# EAGLE design Thru Hole Update Nixie Board (EAGLE 9.6.2)
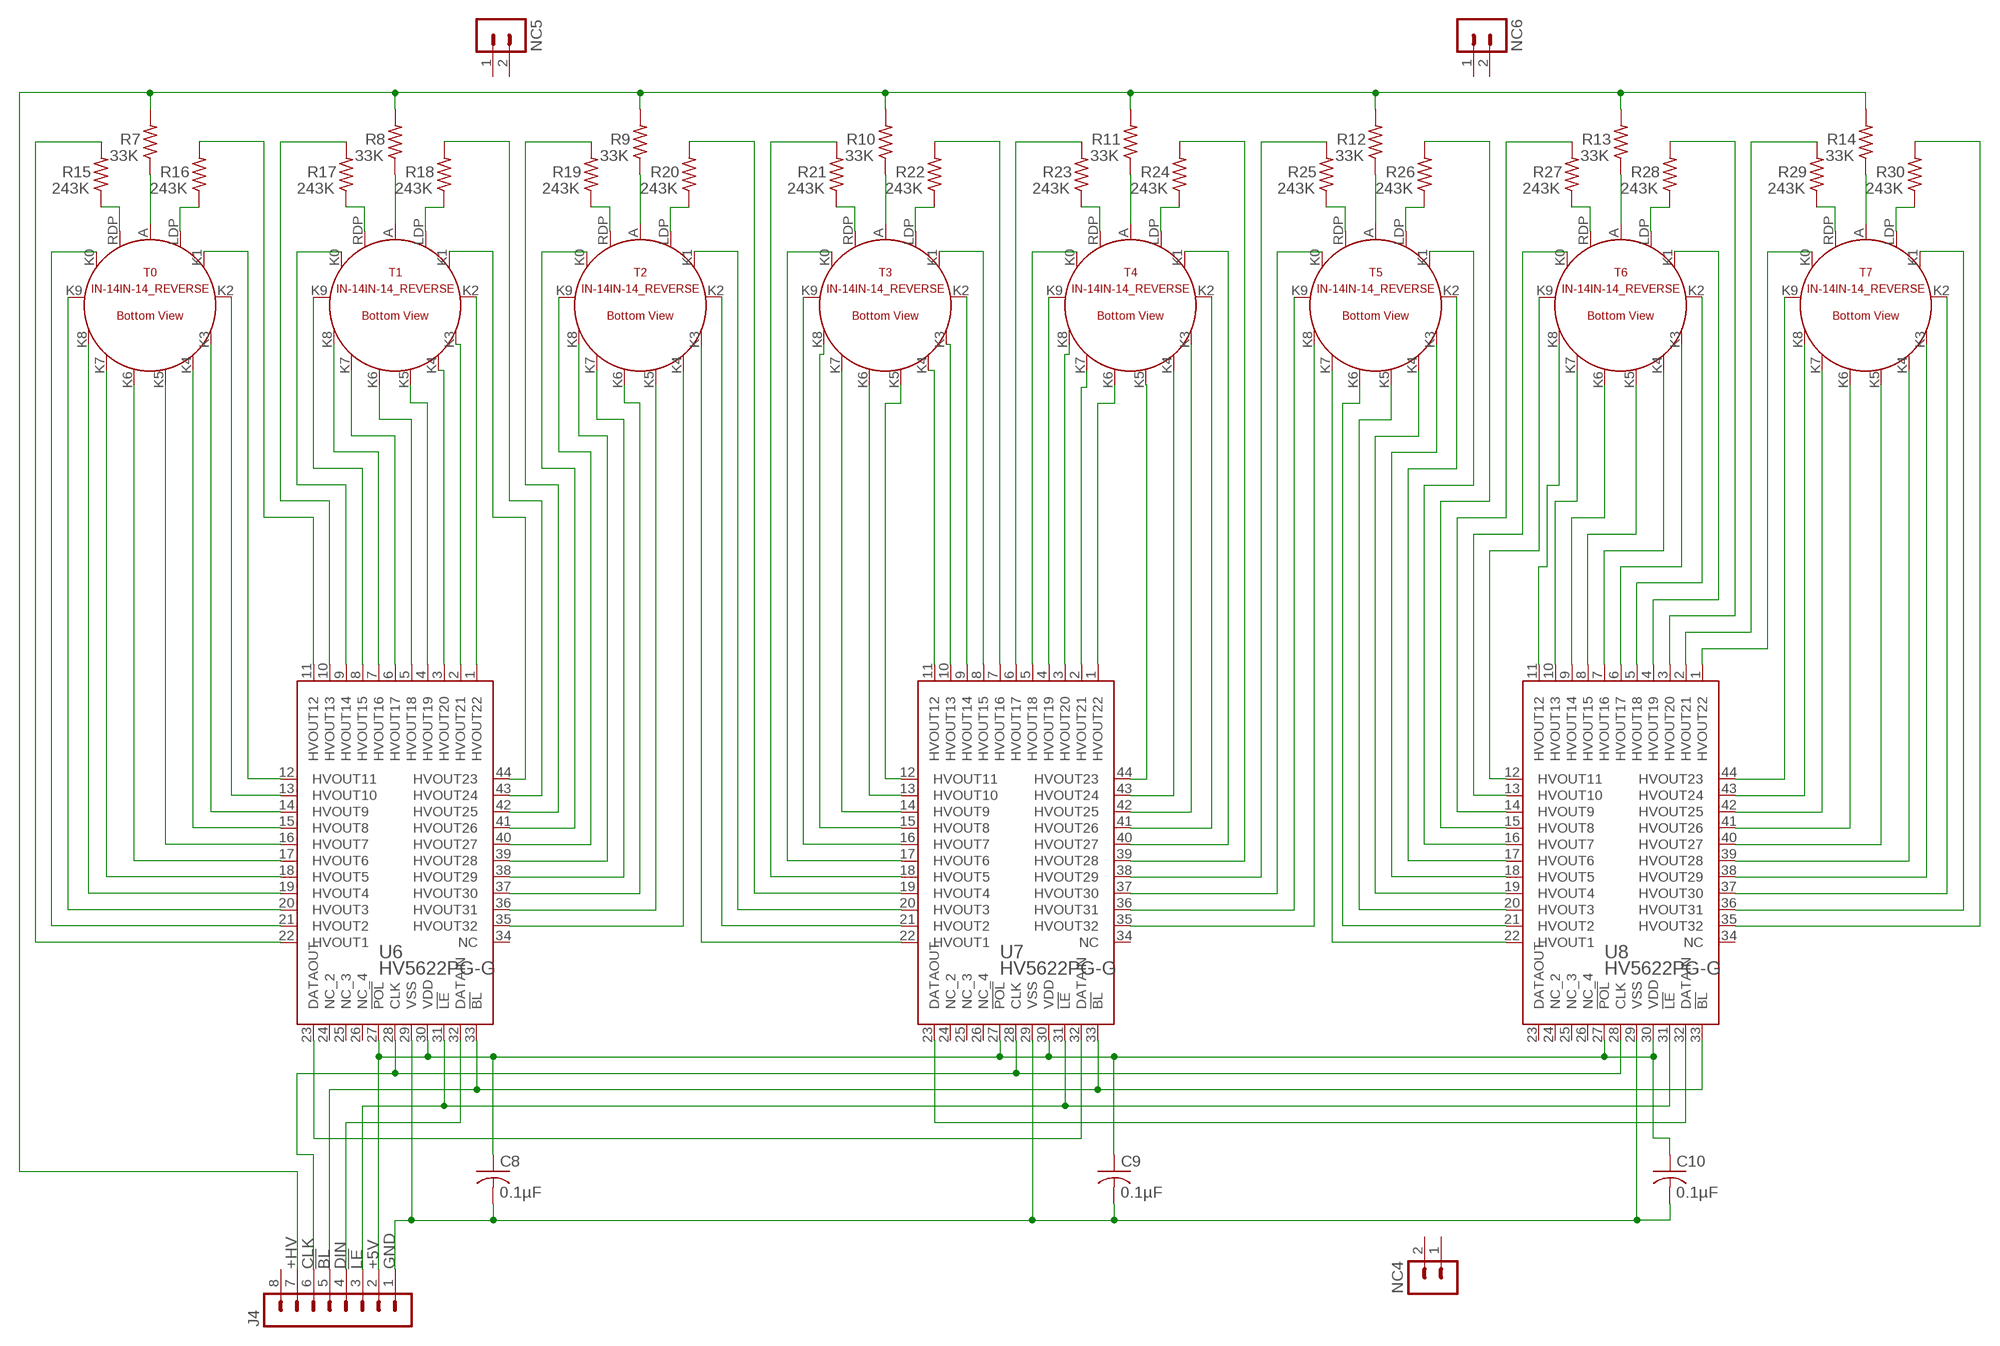
[diagram p0: schematic, sheet 1]

## Parts
C8  0.1µF  C-US  [C025-040X050]
C9  0.1µF  C-US  [C025-040X050]
C10  0.1µF  C-US  [C025-040X050]
J4  1  MA08  [MA08]
NC4  MA02  [MA02]
NC5  MA02  [MA02]
NC6  MA02  [MA02]
R7  33K  R-US0207/10  [0207/10]
R8  33K  R-US0207/10  [0207/10]
R9  33K  R-US0207/10  [0207/10]
R10  33K  R-US0207/10  [0207/10]
R11  33K  R-US0207/10  [0207/10]
R12  33K  R-US0207/10  [0207/10]
R13  33K  R-US0207/10  [0207/10]
R14  33K  R-US0207/10  [0207/10]
R15  243K  R-US0207/10  [0207/10]
R16  243K  R-US0207/10  [0207/10]
R17  243K  R-US0207/10  [0207/10]
R18  243K  R-US0207/10  [0207/10]
R19  243K  R-US0207/10  [0207/10]
R20  243K  R-US0207/10  [0207/10]
R21  243K  R-US0207/10  [0207/10]
R22  243K  R-US0207/10  [0207/10]
R23  243K  R-US0207/10  [0207/10]
R24  243K  R-US0207/10  [0207/10]
R25  243K  R-US0207/10  [0207/10]
R26  243K  R-US0207/10  [0207/10]
R27  243K  R-US0207/10  [0207/10]
R28  243K  R-US0207/10  [0207/10]
R29  243K  R-US0207/10  [0207/10]
R30  243K  R-US0207/10  [0207/10]
T0  IN-14IN-14_REVERSE  [IN-14_REVERSE]
T1  IN-14IN-14_REVERSE  [IN-14_REVERSE]
T2  IN-14IN-14_REVERSE  [IN-14_REVERSE]
T3  IN-14IN-14_REVERSE  [IN-14_REVERSE]
T4  IN-14IN-14_REVERSE  [IN-14_REVERSE]
T5  IN-14IN-14_REVERSE  [IN-14_REVERSE]
T6  IN-14IN-14_REVERSE  [IN-14_REVERSE]
T7  IN-14IN-14_REVERSE  [IN-14_REVERSE]
U6  HV5622PG-G  [QFP-44]
U7  HV5622PG-G  [QFP-44]
U8  HV5622PG-G  [QFP-44]

## Nets
!BL!: J4.5 U6.33(!BL) U7.33(!BL) U8.33(!BL)
!LE!: J4.3 U6.31(!LE) U7.31(!LE) U8.31(!LE)
+5V: C8.1 C9.1 C10.1 J4.2 U6.27(!POL) U6.30(VDD) U7.27(!POL) U7.30(VDD) U8.27(!POL) U8.30(VDD)
+HV: J4.7 R7.2 R8.2 R9.2 R10.2 R11.2 R12.2 R13.2 R14.2
CLK: J4.6 U6.28(CLK) U7.28(CLK) U8.28(CLK)
DIN: J4.4 U6.32(DATAIN)
GND: C8.2 C9.2 C10.2 J4.1 U6.29(VSS) U7.29(VSS) U8.29(VSS)
T0A: R7.1 T0.A
T1A: R8.1 T1.A
T2A: R9.1 T2.A
T3A: R10.1 T3.A
T4A: R11.1 T4.A
T5A: R12.1 T5.A
T6A: R13.1 T6.A
T7A: R14.1 T7.A
U5-T0K0: T0.K0 U6.21(HVOUT2)
U5-T0K1: T0.K1 U6.12(HVOUT11)
U5-T0K2: T0.K2 U6.13(HVOUT10)
U5-T0K3: T0.K3 U6.14(HVOUT9)
U5-T0K4: T0.K4 U6.15(HVOUT8)
U5-T0K5: T0.K5 U6.16(HVOUT7)
U5-T0K6: T0.K6 U6.17(HVOUT6)
U5-T0K7: T0.K7 U6.18(HVOUT5)
U5-T0K8: T0.K8 U6.19(HVOUT4)
U5-T0K9: T0.K9 U6.20(HVOUT3)
U5-T0LDP: R16.2 U6.11(HVOUT12)
U5-T0LDP1: R16.1 T0.LDP
U5-T0RDP: R15.2 U6.22(HVOUT1)
U5-T0RDP1: R15.1 T0.RDP
U5-T1K0: T1.K0 U6.9(HVOUT14)
U5-T1K1: T1.K1 U6.44(HVOUT23)
U5-T1K2: T1.K2 U6.1(HVOUT22)
U5-T1K3: T1.K3 U6.2(HVOUT21)
U5-T1K4: T1.K4 U6.3(HVOUT20)
U5-T1K5: T1.K5 U6.4(HVOUT19)
U5-T1K6: T1.K6 U6.5(HVOUT18)
U5-T1K7: T1.K7 U6.6(HVOUT17)
U5-T1K8: T1.K8 U6.7(HVOUT16)
U5-T1K9: T1.K9 U6.8(HVOUT15)
U5-T1LDP: R18.2 U6.43(HVOUT24)
U5-T1LDP1: R18.1 T1.LDP
U5-T1RDP: R17.2 U6.10(HVOUT13)
U5-T1RDP1: R17.1 T1.RDP
U5-T2K0: T2.K0 U6.41(HVOUT26)
U5-T2K4: T2.K4 U6.35(HVOUT32)
U5-T2K5: T2.K5 U6.36(HVOUT31)
U5-T2K6: T2.K6 U6.37(HVOUT30)
U5-T2K7: T2.K7 U6.38(HVOUT29)
U5-T2K8: T2.K8 U6.39(HVOUT28)
U5-T2K9: T2.K9 U6.40(HVOUT27)
U5-T2RDP: R19.2 U6.42(HVOUT25)
U5-T2RDP1: R19.1 T2.RDP
U5-U6: U6.23(DATAOUT) U7.32(DATAIN)
U6-T2K1: T2.K1 U7.20(HVOUT3)
U6-T2K2: T2.K2 U7.21(HVOUT2)
U6-T2K3: T2.K3 U7.22(HVOUT1)
U6-T2LDP: R20.2 U7.19(HVOUT4)
U6-T2LDP1: R20.1 T2.LDP
U6-T3K0: T3.K0 U7.17(HVOUT6)
U6-T3K1: T3.K1 U7.8(HVOUT15)
U6-T3K2: T3.K2 U7.9(HVOUT14)
U6-T3K3: T3.K3 U7.10(HVOUT13)
U6-T3K4: T3.K4 U7.11(HVOUT12)
U6-T3K5: T3.K5 U7.12(HVOUT11)
U6-T3K6: T3.K6 U7.13(HVOUT10)
U6-T3K7: T3.K7 U7.14(HVOUT9)
U6-T3K8: T3.K8 U7.15(HVOUT8)
U6-T3K9: T3.K9 U7.16(HVOUT7)
U6-T3LDP: R22.2 U7.7(HVOUT16)
U6-T3LDP1: R22.1 T3.LDP
U6-T3RDP: R21.2 U7.18(HVOUT5)
U6-T3RDP1: R21.1 T3.RDP
U6-T4K0: T4.K0 U7.5(HVOUT18)
U6-T4K1: T4.K1 U7.40(HVOUT27)
U6-T4K2: T4.K2 U7.41(HVOUT26)
U6-T4K3: T4.K3 U7.42(HVOUT25)
U6-T4K4: T4.K4 U7.43(HVOUT24)
U6-T4K5: T4.K5 U7.44(HVOUT23)
U6-T4K6: T4.K6 U7.1(HVOUT22)
U6-T4K7: T4.K7 U7.2(HVOUT21)
U6-T4K8: T4.K8 U7.3(HVOUT20)
U6-T4K9: T4.K9 U7.4(HVOUT19)
U6-T4LDP: R24.2 U7.39(HVOUT28)
U6-T4LDP1: R24.1 T4.LDP
U6-T4RDP: R23.2 U7.6(HVOUT17)
U6-T4RDP1: R23.1 T4.RDP
U6-T5K0: T5.K0 U7.37(HVOUT30)
U6-T5K8: T5.K8 U7.35(HVOUT32)
U6-T5K9: T5.K9 U7.36(HVOUT31)
U6-T5RDP: R25.2 U7.38(HVOUT29)
U6-T5RDP1: R25.1 T5.RDP
U6-U7: U7.23(DATAOUT) U8.32(DATAIN)
U7-T5K1: T5.K1 U8.16(HVOUT7)
U7-T5K2: T5.K2 U8.17(HVOUT6)
U7-T5K3: T5.K3 U8.18(HVOUT5)
U7-T5K4: T5.K4 U8.19(HVOUT4)
U7-T5K5: T5.K5 U8.20(HVOUT3)
U7-T5K6: T5.K6 U8.21(HVOUT2)
U7-T5K7: T5.K7 U8.22(HVOUT1)
U7-T5LDP: R26.2 U8.15(HVOUT8)
U7-T5LDP1: R26.1 T5.LDP
U7-T6K0: T6.K0 U8.13(HVOUT10)
U7-T6K1: T6.K1 U8.4(HVOUT19)
U7-T6K2: T6.K2 U8.5(HVOUT18)
U7-T6K3: T6.K3 U8.6(HVOUT17)
U7-T6K4: T6.K4 U8.7(HVOUT16)
U7-T6K5: T6.K5 U8.8(HVOUT15)
U7-T6K6: T6.K6 U8.9(HVOUT14)
U7-T6K7: T6.K7 U8.10(HVOUT13)
U7-T6K8: T6.K8 U8.11(HVOUT12)
U7-T6K9: T6.K9 U8.12(HVOUT11)
U7-T6LDP: R28.2 U8.3(HVOUT20)
U7-T6LDP1: R28.1 T6.LDP
U7-T6RDP: R27.2 U8.14(HVOUT9)
U7-T6RDP1: R27.1 T6.RDP
U7-T7K0: T7.K0 U8.1(HVOUT22)
U7-T7K1: T7.K1 U8.36(HVOUT31)
U7-T7K2: T7.K2 U8.37(HVOUT30)
U7-T7K3: T7.K3 U8.38(HVOUT29)
U7-T7K4: T7.K4 U8.39(HVOUT28)
U7-T7K5: T7.K5 U8.40(HVOUT27)
U7-T7K6: T7.K6 U8.41(HVOUT26)
U7-T7K7: T7.K7 U8.42(HVOUT25)
U7-T7K8: T7.K8 U8.43(HVOUT24)
U7-T7K9: T7.K9 U8.44(HVOUT23)
U7-T7LDP: R30.2 U8.35(HVOUT32)
U7-T7LDP1: R30.1 T7.LDP
U7-T7RDP: R29.2 U8.2(HVOUT21)
U7-T7RDP1: R29.1 T7.RDP
Unconnected: J4.8 NC4.1 NC4.2 NC5.1 NC5.2 NC6.1 NC6.2 U6.24(NC_2) U6.25(NC_3) U6.26(NC_4) U6.34(NC) U7.24(NC_2) U7.25(NC_3) U7.26(NC_4) U7.34(NC) U8.23(DATAOUT) U8.24(NC_2) U8.25(NC_3) U8.26(NC_4) U8.34(NC)

## Library data of the parts
C8-C10 = My Imported Components:C-US
J4 = My Imported Components:MA08: PIN HEADER; OC_FARNELL: unknown; OC_NEWARK: unknown
NC4-NC6 = My Imported Components:MA02: PIN HEADER
R7-R30 = My Imported Components:R-US: RESISTOR, American symbol; SPICEPREFIX: R
T0 T1-T7 = My Imported Components:IN-14
U6-U8 = My Imported Components:HV5622PG-G; BUILT_BY: EMA_Jessica; COPYRIGHT: Copyright (C) 2018 Accelerated Designs. All rights reserved; MANUFACTURER_PART_NUMBER: HV5622PG-G; SOURCELIBRARY: Microchip_2019-08-23_19; VENDOR: Microchip

## Board
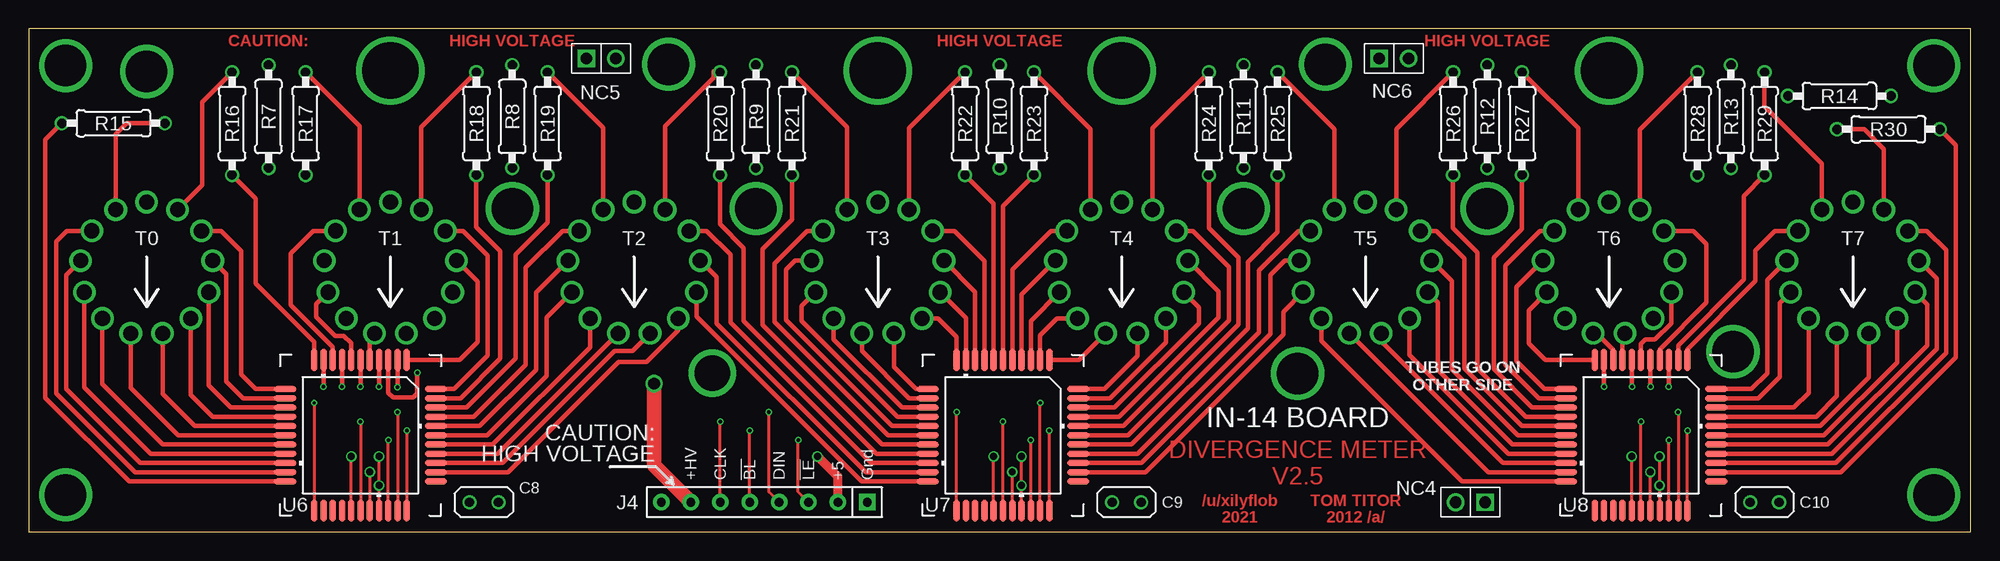
[diagram p1: board, top side]
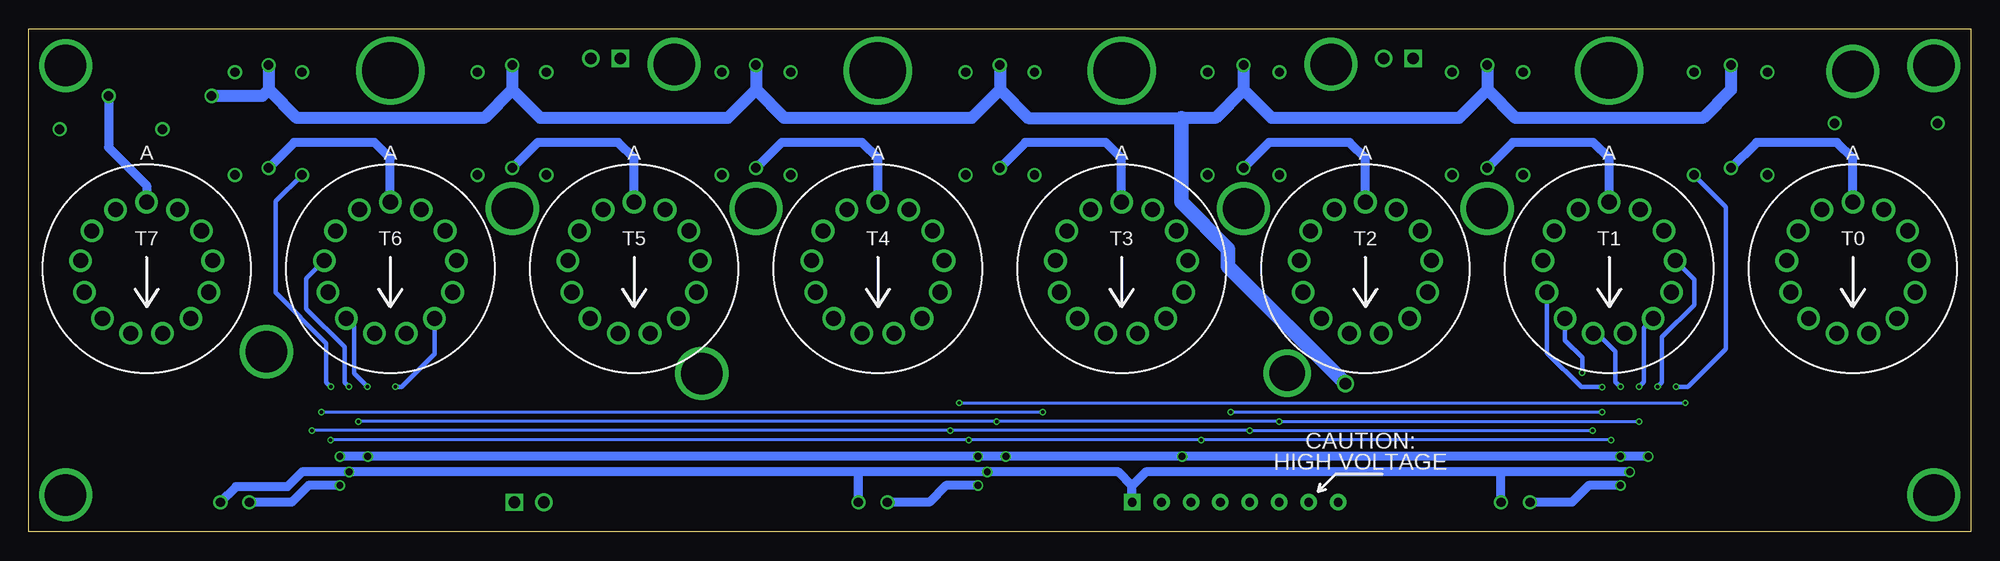
[diagram p2: board, bottom side, seen from below]

Size 167.64 x 43.43 mm. Coordinates in mm from the lower left corner, seen from the top.
Outline: 0,0 167.64,0 167.64,43.43 0,43.43 0,0
Copper layers (1*16): Top 0.035559375mm / dielectric 1.6mm / Bottom 0.035559375mm
Design rules "oshpark-2layer": minimum track width 6mil, minimum drill 10mil, track to track 6mil, track to pad 6mil, pad to pad 6mil, via to via 6mil, smd to smd 6mil, copper to edge 15mil, drill to drill 6mil, minimum pad ring 5mil, minimum via ring 5mil, stop-mask expansion 2.5mil, vias tented up to drill 0mil, thermal gap 10mil

### Footprints (pad centres in the part's own frame; a part is rotated, then mirrored left to right if it is on the bottom)
C025-040X050 = drill 0.813: 1 -1.25,0; 2 1.25,0
MA08 = drill 0.75 pad 1.422 square: 1 -8.89,0 | drill 0.75 pad 1.422: 2 -6.35,0; 3 -3.81,0; 4 -1.27,0; 5 1.27,0; 6 3.81,0; 7 6.35,0; 8 8.89,0
MA02 = drill 1 pad 1.422 square: 1 -1.27,0 | drill 1.016 pad 1.422: 2 1.27,0
0207/10 = drill 0.813: 1 -4.445,0; 2 4.445,0
IN-14_REVERSE = drill 1.3 pad 1.9: A 0,5.75; K0 4.732,3.266; K1 -4.732,3.266; K2 -5.708,0.693; K3 -5.376,-2.039; K4 -3.813,-4.304; K5 -1.376,-5.583; K6 1.376,-5.583; K7 3.813,-4.304; K8 5.376,-2.039; K9 5.708,0.693; LDP -2.672,5.091; RDP 2.672,5.091
QFP-44 = smd 1.9 x 0.55: 1 -6.5,4; 2 -6.5,3.2; 3 -6.5,2.4; 4 -6.5,1.6; 5 -6.5,0.8; 6 -6.5,0; 7 -6.5,-0.8; 8 -6.5,-1.6; 9 -6.5,-2.4; 10 -6.5,-3.2; 11 -6.5,-4; 23 6.5,-4; 24 6.5,-3.2; 25 6.5,-2.4; 26 6.5,-1.6; 27 6.5,-0.8; 28 6.5,0; 29 6.5,0.8; 30 6.5,1.6; 31 6.5,2.4; 32 6.5,3.2; 33 6.5,4 | smd 0.501 x 1.9: 12 -4,-6.5; 13 -3.2,-6.5; 14 -2.4,-6.5; 15 -1.6,-6.5; 16 -0.8,-6.5; 17 0,-6.5; 18 0.8,-6.5; 19 1.6,-6.5; 20 2.4,-6.5; 21 3.2,-6.5; 22 4,-6.5 | smd 0.55 x 1.9: 34 4,6.5; 35 3.2,6.5; 36 2.4,6.5; 37 1.6,6.5; 38 0.8,6.5; 39 0,6.5; 40 -0.8,6.5; 41 -1.6,6.5; 42 -2.4,6.5; 43 -3.2,6.5; 44 -4,6.5

### Placement (x,y rotation side)
C8  39.29,2.54 0 top
C9  94.77,2.54 0 top
C10  149.86,2.54 0 top
J4  63.5,2.54 180 top
NC4  124.46,2.54 180 top
NC5  49.4,40.89 0 top
NC6  117.86,40.89 0 top
R7  20.68,35.86 90 top
R8  41.73,35.86 90 top
R9  62.77,35.86 90 top
R10  83.82,35.86 90 top
R11  104.87,35.86 90 top
R12  125.91,35.86 90 top
R13  146.96,35.86 90 top
R14  156.31,37.64 180 top
R15  7.29,35.28 180 top
R16  17.53,35.26 270 top
R17  23.88,35.26 270 top
R18  38.63,35.26 270 top
R19  44.78,35.26 270 top
R20  59.68,35.26 270 top
R21  65.87,35.26 270 top
R22  80.82,35.26 270 top
R23  86.77,35.26 270 top
R24  101.87,35.26 270 top
R25  107.81,35.26 270 top
R26  122.97,35.26 270 top
R27  128.91,35.26 270 top
R28  144.06,35.26 270 top
R29  149.85,35.26 270 top
R30  160.55,34.77 0 top
T0  10.16,22.73 0 bottom
T1  31.21,22.73 0 bottom
T2  52.25,22.73 0 bottom
T3  73.3,22.73 0 bottom
T4  94.34,22.73 0 bottom
T5  115.39,22.73 0 bottom
T6  136.43,22.73 0 bottom
T7  157.48,22.73 0 bottom
U6  28.63,8.33 270 top
U7  84.1,8.33 270 top
U8  139.19,8.33 270 top

### Tracks (layer width: path | path; a pad name or v marks a point on that pad's centre or on a via)
!BL!  (via drill 0.3 pad 0.55)
  Top 0.254: v32.63,8.74 U6.33 | J4.5 v62.23,8.74 | U7.33 v88.1,8.74 | U8.33 v143.19,8.74
  Bottom 0.254: v32.63,8.74 v62.23,8.74 v88.1,8.74 v143.19,8.74
!LE!  (via drill 0.3 pad 0.55)
  Top 0.254: U6.31 v31.03,7.92 | U7.31 v86.5,7.92 | U8.31 v141.59,7.92 | J4.3 66.42,3.43 v66.42,7.92
  Bottom 0.254: v31.03,7.92 v66.42,7.92 v86.5,7.92 v141.59,7.92
+5V  (via drill 0.6 pad 0.8)
  Top 0.254: U6.27 v27.83,6.5 | U6.30 v30.23,3.99 v30.23,6.5 | U7.30 v85.7,3.99 v85.7,6.5 | U7.27 v83.3,6.5 | U8.30 v140.79,3.99 v140.79,6.5 | U8.27 v138.39,6.5
  Top 0.762: J4.2 69.85,4.72 v68.07,6.5
  Bottom 0.762: v27.83,6.5 v30.23,6.5 v68.07,6.5 v83.3,6.5 v85.7,6.5 v138.39,6.5 v140.79,6.5 | v140.79,3.99 143.51,3.99 144.96,2.54 C10.1 | C9.1 89.89,2.54 88.44,3.99 v85.7,3.99 | v30.23,3.99 32.97,3.99 34.42,2.54 C8.1
+HV  (via drill 1 pad 1.5)
  Top 1.27: v53.98,12.8 53.98,5.71 J4.7
  Bottom 1.016: R7.2 20.68,38.18 23.12,35.74 39.29,35.74 41.73,38.18 | R8.2 41.73,38.18 | 41.73,38.18 44.17,35.74 60.34,35.74 62.77,38.18 | R9.2 62.77,38.18 | R10.2 83.82,38.18 | R11.2 104.87,38.18 | R12.2 125.91,38.18 | R13.2 146.96,38.18 | 146.96,38.18 144.52,35.74 128.35,35.74 125.91,38.18 | 125.91,38.18 123.47,35.74 107.3,35.74 104.87,38.18 | 104.87,38.18 102.43,35.74 86.26,35.74 83.82,38.18 | 83.82,38.18 81.38,35.74 68.15,35.74 65.21,35.74 62.77,38.18 | 146.96,38.18 147.49,37.64 R14.2
  Bottom 1.27: v53.98,12.8 64.11,22.91 64.11,24.43 68.15,28.5 68.15,35.74
CLK  (via drill 0.3 pad 0.55)
  Top 0.254: v28.63,9.53 U6.28 | J4.6 v59.69,9.53 | U7.28 v84.1,9.53 | U8.28 v139.19,9.53
  Bottom 0.254: v28.63,9.53 v59.69,9.53 v84.1,9.53 v139.19,9.53
DIN  (via drill 0.3 pad 0.55)
  Top 0.254: v31.83,10.34 U6.32 | J4.4 63.88,3.43 v63.88,10.34
  Bottom 0.254: v63.88,10.34 v31.83,10.34
GND  (via drill 0.6 pad 0.8)
  Top 0.254: v29.43,5.16 U6.29 | U7.29 v84.9,5.16 | U8.29 v139.99,5.16
  Bottom 0.762: v29.43,5.16 40.54,5.16 | 40.54,5.16 71.2,5.16 72.39,3.96 | 96.01,5.16 v84.9,5.16 73.58,5.16 72.39,3.96 | 96.01,5.16 v139.99,5.16 144.07,5.16 145.34,3.89 149.76,3.89 C10.2 | C9.2 96.02,5.15 96.01,5.16 | C8.2 40.54,5.15 40.54,5.16 | J4.1 72.39,3.96
N$1  (via drill 3.05 pad 3.48)
  other vias: 59,13.69
N$2  (via drill 3.58 pad 4.01)
  other vias: 55.22,40.39
N$3  (via drill 3.58 pad 4.01)
  other vias: 104.87,27.91
N$4  (via drill 3.58 pad 4.01)
  other vias: 62.77,27.91
N$5  (via drill 3.58 pad 4.01)
  other vias: 10.16,39.75
N$6  (via drill 3.58 pad 4.01)
  other vias: 109.55,13.67
N$7  (via drill 3.58 pad 4.01)
  other vias: 111.94,40.39
N$8  (via drill 3.58 pad 4.01)
  other vias: 41.73,27.91
N$9  (via drill 3.58 pad 4.01)
  other vias: 147.14,15.54
N$10  (via drill 3.58 pad 4.27)
  other vias: 3.17,3.17
N$11  (via drill 3.58 pad 4.27)
  other vias: 164.47,3.17
N$12  (via drill 3.58 pad 4.27)
  other vias: 3.17,40.26
N$13  (via drill 3.58 pad 4.27)
  other vias: 164.47,40.26
N$14  (via drill 4.88 pad 5.59)
  other vias: 73.3,39.83
N$15  (via drill 4.88 pad 5.59)
  other vias: 94.34,39.83
N$16  (via drill 4.88 pad 5.59)
  other vias: 136.43,39.83
N$17  (via drill 4.88 pad 5.59)
  other vias: 31.21,39.83
N$18  (via drill 3.58 pad 4.01)
  other vias: 125.91,27.91
T0A
  Bottom 0.762: T0.A 10.16,32.26 11.53,33.63 18.47,33.63 R7.1
T1A
  Bottom 0.762: T1.A 31.21,32.26 32.58,33.63 39.52,33.63 R8.1
T2A
  Bottom 0.762: T2.A 52.25,32.26 53.62,33.63 60.56,33.63 R9.1
T3A
  Bottom 0.762: T3.A 73.3,32.26 74.67,33.63 81.61,33.63 R10.1
T4A
  Bottom 0.762: T4.A 94.34,32.26 95.71,33.63 102.66,33.63 R11.1
T5A
  Bottom 0.762: T5.A 115.39,32.26 116.76,33.63 123.7,33.63 R12.1
T6A
  Bottom 0.762: T6.A 136.43,32.26 137.81,33.63 144.75,33.63 R13.1
T7A
  Bottom 0.762: T7.A 157.48,29.92 160.76,33.2 R14.1
U5-T0K0
  Top 0.381: U6.21 9.17,5.13 2.34,11.96 2.34,25.08 3.25,25.99 T0.K0
U5-T0K1
  Top 0.381: U6.12 19.58,12.33 18.31,13.6 18.31,24.26 16.58,25.99 T0.K1
U5-T0K2
  Top 0.381: U6.13 18.48,11.53 17.04,12.97 17.04,22.24 T0.K2
U5-T0K3
  Top 0.381: U6.14 17.43,10.73 15.54,12.62 T0.K3
U5-T0K4
  Top 0.381: U6.15 15.88,9.93 13.97,11.84 T0.K4
U5-T0K5
  Top 0.381: U6.16 14.29,9.13 11.54,11.89 T0.K5
U5-T0K6
  Top 0.381: U6.17 12.87,8.33 8.78,12.42 T0.K6
U5-T0K7
  Top 0.381: U6.18 11.57,7.53 6.35,12.75 T0.K7
U5-T0K8
  Top 0.381: U6.19 10.5,6.73 4.78,12.45 T0.K8
U5-T0K9
  Top 0.381: U6.20 9.61,5.93 3.23,12.32 3.23,22.19 T0.K9
U5-T0LDP
  Top 0.381: U6.11 24.63,16.39 19.58,21.44 19.58,28.76 R16.2
U5-T0LDP1
  Top 0.381: T0.LDP 14.96,29.95 14.96,37.13 R16.1
U5-T0RDP
  Top 0.381: U6.22 8.65,4.33 1.42,11.56 1.42,33.86 R15.2
U5-T0RDP1
  Top 0.381: T0.RDP 7.49,34.34 8.43,35.28 R15.1
U5-T1K0
  Top 0.381: U6.9 26.23,15.95 22.59,19.58 22.59,24.03 24.56,25.99 T1.K0
U5-T1K1
  Top 0.381: U6.44 36.73,12.33 39.61,15.21 39.61,23.85 37.47,25.99 T1.K1
U5-T1K2
  Top 0.381: U6.1 37.17,14.83 38.72,16.38 38.72,21.61 T1.K2
U5-T1K3  (via drill 0.3 pad 0.55)
  Top 0.381: U6.2 v31.83,12.5
  Bottom 0.381: v31.83,12.5 33.62,12.5 36.58,15.46 T1.K3
U5-T1K4  (via drill 0.3 pad 0.55)
  Top 0.381: U6.3 31.03,12 31.45,11.58 33.17,11.58 33.53,11.94 v33.53,13.74
  Bottom 0.381: v33.53,13.74 33.53,15.04 35.02,16.53 T1.K4
U5-T1K5  (via drill 0.3 pad 0.55)
  Top 0.381: U6.4 v30.23,12.52
  Bottom 0.381: v30.23,12.52 30.65,12.94 30.65,15.56 32.23,17.14 T1.K5
U5-T1K6
  Top 0.381: U6.5 29.43,16.74 T1.K6
U5-T1K7  (via drill 0.3 pad 0.55)
  Top 0.381: U6.6 v28.63,12.52
  Bottom 0.381: v28.63,12.52 28.21,12.94 28.21,17.61 T1.K7
U5-T1K8
  Top 0.381: U6.7 27.83,16.28 27.19,16.92 26.43,16.92 24.8,18.54 24.8,19.66 T1.K8
U5-T1K9  (via drill 0.3 pad 0.55)
  Top 0.381: U6.8 v27.03,12.52
  Bottom 0.381: v27.03,12.52 26.63,12.91 26.63,16.82 23.86,19.58 23.86,21.79 T1.K9
U5-T1LDP
  Top 0.381: U6.43 37.26,11.53 40.69,14.96 40.69,24.25 38.63,26.31 R18.2
U5-T1LDP1
  Top 0.381: T1.LDP 33.88,34.95 R18.1
U5-T1RDP  (via drill 0.3 pad 0.55)
  Top 0.381: U6.10 v25.43,12.52
  Bottom 0.381: v25.43,12.52 24.41,12.52 21.13,15.8 21.13,28.06 R17.2
U5-T1RDP1
  Top 0.381: T1.RDP 28.53,35.05 R17.1
U5-T2K0
  Top 0.381: U6.41 38.38,9.93 42.88,14.43 42.88,22.81 46.06,25.99 T2.K0
U5-T2K4
  Top 0.381: U6.35 41.38,5.13 50.91,14.66 53.32,14.66 56.06,17.4 T2.K4
U5-T2K5
  Top 0.381: U6.36 40.88,5.93 50.58,15.62 52.11,15.62 T2.K5
U5-T2K6
  Top 0.381: U6.37 40.46,6.73 T2.K6
U5-T2K7
  Top 0.381: U6.38 40.05,7.53 48.44,15.92 T2.K7
U5-T2K8
  Top 0.381: U6.39 39.58,8.33 44.68,13.44 44.68,18.49 T2.K8
U5-T2K9
  Top 0.381: U6.40 38.93,9.13 43.77,13.97 43.77,20.64 T2.K9
U5-T2RDP
  Top 0.381: U6.42 37.78,10.73 42.04,14.99 42.04,23.96 44.78,26.7 R19.2
U5-T2RDP1
  Top 0.381: R19.1 49.58,34.9 T2.RDP
U5-U6  (via drill 0.3 pad 0.55)
  Top 0.254: v24.63,11.12 U6.23 | U7.32 v87.3,11.12
  Bottom 0.254: v87.3,11.12 v24.63,11.12
U6-T2K1
  Top 0.381: U7.20 72.71,5.93 60.58,18.06 60.58,23.93 58.52,25.99 T2.K1
U6-T2K2
  Top 0.381: U7.21 72.27,5.13 59.39,18.01 59.39,21.99 T2.K2
U6-T2K3
  Top 0.381: U7.22 71.87,4.33 57.63,18.58 T2.K3
U6-T2LDP
  Top 0.381: U7.19 73.2,6.73 61.72,18.21 61.72,24.51 59.67,26.56 R20.2
U6-T2LDP1
  Top 0.381: R20.1 59.13,39.79 59.13,39.23 54.92,35.02 T2.LDP
U6-T3K0
  Top 0.381: U7.17 74.16,8.33 64.36,18.14 64.36,23.16 67.18,25.99 T3.K0
U6-T3K1
  Top 0.381: U7.8 82.5,23.39 79.89,25.99 T3.K1
U6-T3K2
  Top 0.381: U7.9 81.7,20.72 T3.K2
U6-T3K3
  Top 0.381: U7.10 80.9,18.46 T3.K3
U6-T3K4
  Top 0.381: U7.11 80.1,16.82 78.5,18.42 T3.K4
U6-T3K5
  Top 0.381: U7.12 76.59,12.33 74.67,14.24 T3.K5
U6-T3K6
  Top 0.381: U7.13 75.99,11.53 71.92,15.6 T3.K6
U6-T3K7
  Top 0.381: U7.14 75.37,10.73 69.48,16.61 T3.K7
U6-T3K8
  Top 0.381: U7.15 75,9.93 66.72,18.21 66.72,19.48 T3.K8
U6-T3K9
  Top 0.381: U7.16 74.53,9.13 65.37,18.29 65.37,22.66 66.13,23.42 T3.K9
U6-T3LDP
  Top 0.381: R22.2 83.3,28.33 U7.7
U6-T3LDP1
  Top 0.381: R22.1 75.97,34.85 T3.LDP
U6-T3RDP
  Top 0.381: U7.18 73.65,7.53 63.32,17.86 63.32,24.42 65.87,26.98 R21.2
U6-T3RDP1
  Top 0.381: R21.1 70.62,34.95 T3.RDP
U6-T4K0
  Top 0.381: U7.5 84.9,22.66 88.23,25.99 T4.K0
U6-T4K1
  Top 0.381: U7.40 94.51,9.13 103.61,18.24 103.61,22.89 100.51,25.99 T4.K1
U6-T4K2
  Top 0.381: U7.41 94.11,9.93 102.7,18.52 102.7,20.77 T4.K2
U6-T4K3
  Top 0.381: U7.42 93.75,10.73 101.02,18.01 101.02,19.38 T4.K3
U6-T4K4
  Top 0.381: U7.43 93.35,11.53 98.16,16.34 T4.K4
U6-T4K5
  Top 0.381: U7.44 92.86,12.33 95.72,15.19 T4.K5
U6-T4K6
  Top 0.381: U7.1 90.66,14.83 T4.K6
U6-T4K7
  Top 0.381: U7.2 87.3,16.96 88.76,18.42 T4.K7
U6-T4K8
  Top 0.381: U7.3 86.5,18.22 T4.K8
U6-T4K9
  Top 0.381: U7.4 85.7,20.48 T4.K9
U6-T4LDP
  Top 0.381: U7.39 94.87,8.33 104.42,17.88 104.42,23.69 101.87,26.24 R24.2
U6-T4LDP1
  Top 0.381: R24.1 97.02,34.85 T4.LDP
U6-T4RDP
  Top 0.381: R23.2 84.1,28.14 U7.6
U6-T4RDP1
  Top 0.381: R23.1 91.67,34.8 T4.RDP
U6-T5K0
  Top 0.381: U7.37 95.7,6.73 106.19,17.22 106.19,22.58 109.61,25.99 T5.K0
U6-T5K8
  Top 0.381: U7.35 96.42,5.13 108.33,17.04 108.33,19 T5.K8
U6-T5K9
  Top 0.381: U7.36 96.07,5.93 107.21,17.07 107.21,22.17 108.45,23.42 T5.K9
U6-T5RDP
  Top 0.381: U7.38 95.21,7.53 105.26,17.58 105.26,23.32 107.81,25.87 R25.2
U6-T5RDP1
  Top 0.381: R25.1 112.72,34.8 T5.RDP
U6-U7  (via drill 0.3 pad 0.55)
  Top 0.254: U7.23 v80.1,10.34 | v142.39,10.34 U8.32
  Bottom 0.254: v142.39,10.34 v80.1,10.34
U7-T5K1
  Top 0.381: U8.16 128.91,9.13 123.92,14.12 123.92,23.6 121.53,25.99 T5.K1
U7-T5K2
  Top 0.381: U8.17 128.55,8.33 122.86,14.02 122.86,21.66 T5.K2
U7-T5K3
  Top 0.381: U8.18 128.1,7.53 121.64,13.99 121.64,19.82 T5.K3
U7-T5K4
  Top 0.381: U8.19 127.73,6.73 119.2,15.26 T5.K4
U7-T5K5
  Top 0.381: U8.20 127.26,5.93 116.77,16.43 T5.K5
U7-T5K6
  Top 0.381: U8.21 126.02,5.13 T5.K6
U7-T5K7
  Top 0.381: U8.22 123.71,4.33 111.58,16.46 T5.K7
U7-T5LDP
  Top 0.381: U8.15 129.26,9.93 125.07,14.12 125.07,24.11 122.97,26.21 R26.2
U7-T5LDP1
  Top 0.381: R26.1 118.06,34.8 T5.LDP
U7-T6K0
  Top 0.381: U8.13 130.36,11.53 127.47,14.43 127.47,22.99 130.47,25.99 T6.K0
U7-T6K1
  Top 0.381: U8.4 140.79,15.74 144.84,19.79 144.84,24.87 143.72,25.99 T6.K1
U7-T6K2  (via drill 0.3 pad 0.55)
  Top 0.381: U8.5 139.99,12.54 v140,12.52
  Bottom 0.381: v140,12.52 140.4,12.91 140.4,15.95 143.7,19.25 143.7,21.86 T6.K2
U7-T6K3
  Top 0.381: U8.6 139.19,16.23 139.55,16.59 140.39,16.59 141.81,18.01 T6.K3
U7-T6K4  (via drill 0.3 pad 0.55)
  Top 0.381: U8.7 138.39,12.54 v138.41,12.52
  Bottom 0.381: v138.41,12.52 139.56,13.68 139.56,17.73 T6.K4
U7-T6K5
  Top 0.381: U8.8 137.59,16.92 T6.K5
U7-T6K6
  Top 0.381: U8.9 136.79,15.72 135.37,17.14 T6.K6
U7-T6K7  (via drill 0.3 pad 0.55)
  Top 0.381: U8.10 v135.99,12.52
  Bottom 0.381: T6.K7 132.62,15.37 135.47,12.52 v135.99,12.52
U7-T6K8
  Top 0.381: U8.11 130.95,14.83 129.5,16.28 129.5,19.13 T6.K8
U7-T6K9
  Top 0.381: U8.12 130.86,12.33 128.43,14.76 128.43,21.12 T6.K9
U7-T6LDP  (via drill 0.3 pad 0.55)
  Top 0.381: U8.3 141.59,12.54 v141.58,12.52
  Bottom 0.381: v141.58,12.52 141.96,12.9 141.96,16.28 146.33,20.65 146.33,28.54 R28.2
U7-T6LDP1
  Top 0.381: R28.1 139.11,34.74 T6.LDP
U7-T6RDP
  Top 0.381: U8.14 129.78,10.73 126.47,14.05 126.47,23.7 128.91,26.14 R27.2
U7-T6RDP1
  Top 0.381: R27.1 133.76,34.85 T6.RDP
U7-T7K0
  Top 0.381: U8.1 143.19,15.76 149.07,21.64 149.07,24.31 150.76,25.99 T7.K0
U7-T7K1
  Top 0.381: U8.36 156.02,5.93 165.53,15.44 165.53,24.33 163.87,25.99 T7.K1
U7-T7K2
  Top 0.381: U8.37 155.68,6.73 164.72,15.77 164.72,21.89 T7.K2
U7-T7K3
  Top 0.381: U8.38 155.33,7.53 163.91,16.1 163.91,19.64 T7.K3
U7-T7K4
  Top 0.381: U8.39 154.99,8.33 161.29,14.63 T7.K4
U7-T7K5
  Top 0.381: T7.K5 158.86,13.34 154.65,9.13 U8.40
U7-T7K6
  Top 0.381: U8.41 154.31,9.93 156.1,11.73 T7.K6
U7-T7K7
  Top 0.381: U8.42 152.4,10.73 153.67,12 T7.K7
U7-T7K8
  Top 0.381: U8.43 149.3,11.53 151.16,13.39 151.16,19.74 T7.K8
U7-T7K9
  Top 0.381: U8.44 148.73,12.33 150.09,13.69 150.09,21.73 T7.K9
U7-T7LDP
  Top 0.381: U8.35 156.44,5.13 166.37,15.06 166.37,33.4 R30.2
U7-T7LDP1
  Top 0.381: T7.LDP 160.15,33.07 158.44,34.77 R30.1
U7-T7RDP
  Top 0.381: U8.2 142.39,16.1 148.06,21.77 148.06,29.01 R29.2
U7-T7RDP1
  Top 0.381: T7.RDP 154.81,31.8 149.85,36.75 R29.1

### Text on the board
Top: CAUTION: | HIGH VOLTAGE | HIGH VOLTAGE | HIGH VOLTAGE | DIVERGENCE METER / V2.5 | /u/xilyflob / 2021 | TOM TITOR / 2012 /a/
tPlace: T0 | T1 | T2 | T3 | T4 | T5 | T6 | T7 | TUBES GO ON / OTHER SIDE | IN-14 BOARD | CAUTION: / HIGH VOLTAGE | +HV | CLK | !BL! | DIN | !LE! | +5 | Gnd
bPlace: CAUTION: / HIGH VOLTAGE
tStop: CAUTION: | HIGH VOLTAGE | HIGH VOLTAGE | HIGH VOLTAGE | DIVERGENCE METER / V2.5 | /u/xilyflob / 2021 | TOM TITOR / 2012 /a/